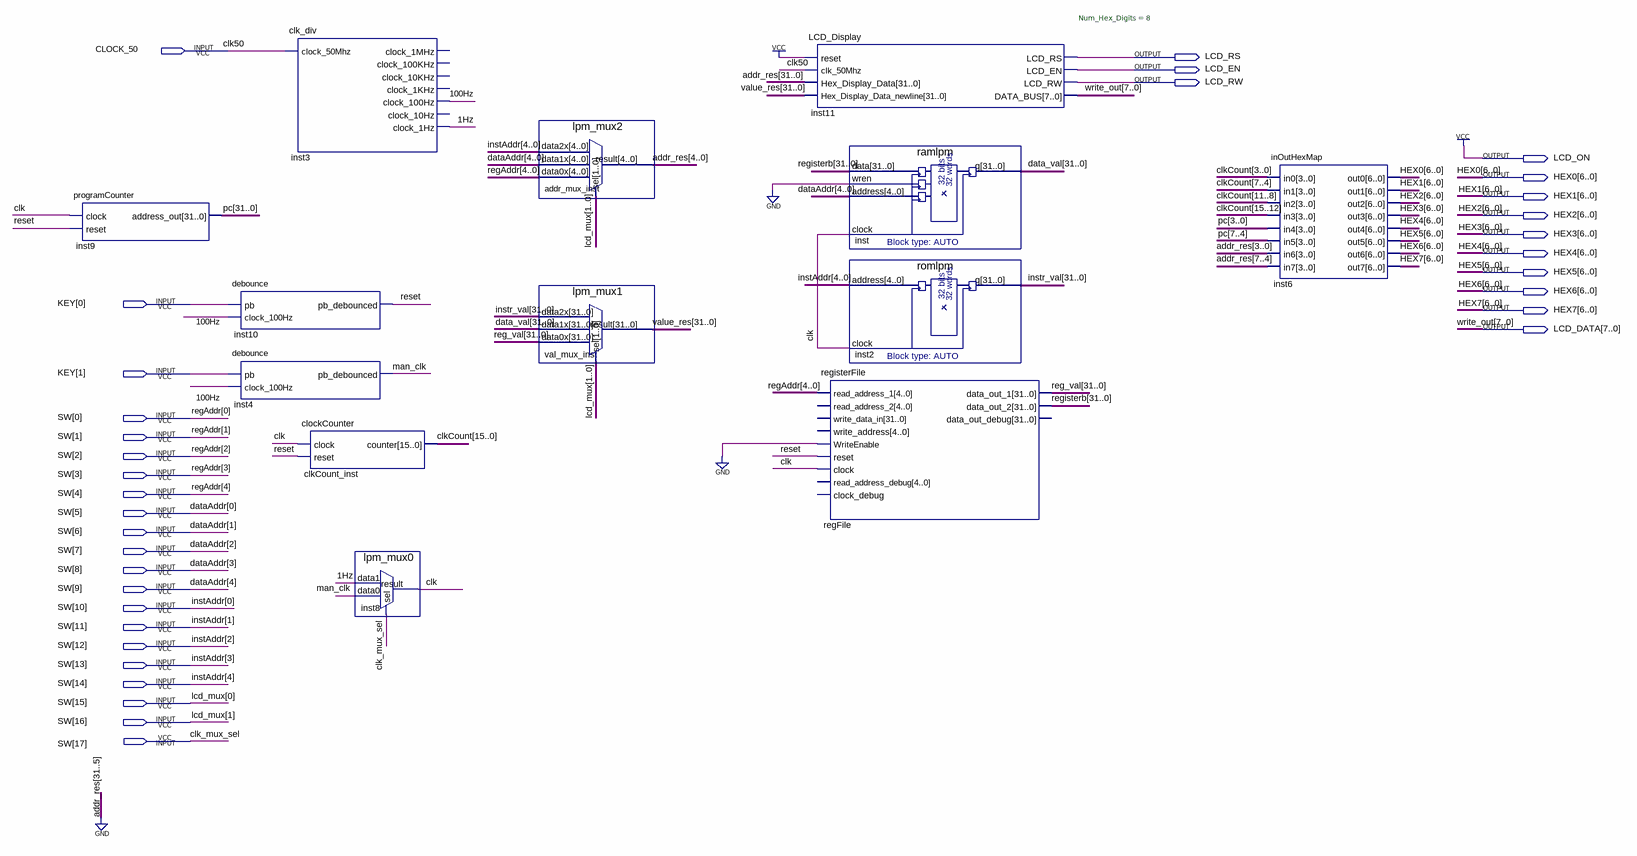
[diagram p0: schematic sheet]
// Quartus schematic schematic.bdf as structural Verilog: 13 symbols, 34 pins
module schematic (
  input  CLOCK_50,
  input  [1:0] KEY,
  input  [17:0] SW,
  output LCD_RS,
  output LCD_EN,
  output LCD_RW,
  output LCD_ON,
  output [6:0] HEX0,
  output [6:0] HEX1,
  output [6:0] HEX2,
  output [6:0] HEX3,
  output [6:0] HEX4,
  output [6:0] HEX5,
  output [6:0] HEX6,
  output [6:0] HEX7,
  output [7:0] LCD_DATA
);

  wire \1Hz , \100Hz , clk, man_clk, reset;
  wire [4:0] addr_res;
  wire [15:0] clkCount;
  wire [31:0] data_val, instr_val, pc, reg_val, registerb, value_res;

  programCounter inst9 (.clock(clk), .reset(reset), .address_out(pc));
  debounce inst10 (.pb(KEY[0]), .clock_100Hz(\100Hz ), .pb_debounced(reset));
  debounce inst4 (.pb(KEY[1]), .clock_100Hz(\100Hz ), .pb_debounced(man_clk));
  clk_div inst3 (
    .clock_50Mhz(CLOCK_50), .clock_100Hz(\100Hz ), .clock_1Hz(\1Hz ));  // open: clock_1MHz, clock_100KHz, clock_10KHz, clock_1KHz, clock_10Hz
  clockCounter clkCount_inst (.clock(clk), .reset(reset), .counter(clkCount));
  lpm_mux0 inst8 (.data1(\1Hz ), .data0(man_clk), .sel(SW[17]), .result(clk));
  lpm_mux2 addr_mux_inst (.data2x(SW[14:10]), .data1x(SW[9:5]), .data0x(SW[4:0]), .sel(SW[16:15]), .result(addr_res));
  lpm_mux1 val_mux_inst (.data2x(instr_val), .data1x(data_val), .data0x(reg_val), .sel(SW[16:15]), .result(value_res));
  LCD_Display #(.Num_Hex_Digits(8)) inst11 (
    .reset(1'b1), .Hex_Display_Data({{27{1'b0}}, addr_res}), .clk_50Mhz(CLOCK_50),
    .Hex_Display_Data_newline(value_res), .LCD_RS(LCD_RS), .LCD_EN(LCD_EN), .LCD_RW(LCD_RW),
    .DATA_BUS(LCD_DATA));
  ramlpm inst (.data(registerb), .wren(1'b0), .address(SW[9:5]), .clock(clk), .q(data_val));
  romlpm inst2 (.address(SW[14:10]), .clock(clk), .q(instr_val));
  registerFile regFile (
    .read_address_1(SW[4:0]), .WriteEnable(1'b0), .reset(reset), .clock(clk), .data_out_1(reg_val),
    .data_out_2(registerb));  // open: read_address_2, write_data_in, write_address, read_address_debug, clock_debug, data_out_debug
  inOutHexMap inst6 (
    .in0(clkCount[3:0]), .in1(clkCount[7:4]), .in2(clkCount[11:8]), .in3(clkCount[15:12]), .in4(pc[3:0]),
    .in5(pc[7:4]), .in6(addr_res[3:0]), .in7({3'b000, addr_res[4]}), .out0(HEX0), .out1(HEX1), .out2(HEX2),
    .out3(HEX3), .out4(HEX4), .out5(HEX5), .out6(HEX6), .out7(HEX7));

  assign LCD_ON = 1'b1;

  // Other names for the same wires on the sheet: clk50 = CLOCK_50; clk_mux_sel = SW[17]; dataAddr[4:0] = SW[9:5];
  //   instAddr[4:0] = SW[14:10]; lcd_mux[1:0] = SW[16:15]; regAddr[4:0] = SW[4:0]; write_out[7:0] = LCD_DATA
endmodule
